# Altium project PCB_Project1.PrjPCB
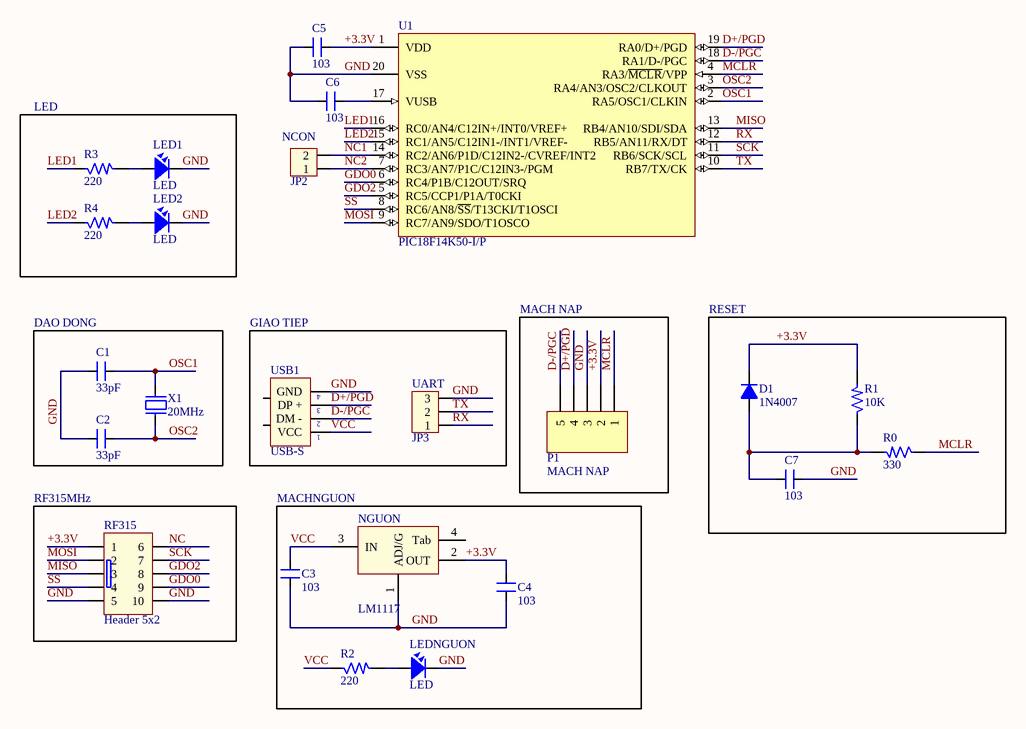
[diagram p0: USB.SchDoc]
1 sheet, 24 parts. Net scope: global (net labels, ports and power ports of the same name join across sheets).
Board files: USB.PcbDoc, UBSRF315.PcbDoc

## Sheet USB.SchDoc
size A

### Parts
C1  33pF  [SM-0805]
C2  33pF  [SM-0805]
C3  103  [SM-0805]
C4  103  [SM-0805]
C5  103  [SM-0805]
C6  103  [CP1/2.5_SM]
C7  103  [SM-0805]
D1  1N4007  [D1A]
LED1  LED  [LED-3]
LED2  LED  [LED-3]
LEDNGUON  LED  [LED-3]
NCON  JP2  [CON2]
NGUON  LM1117  [SOT223-4N]
P1  MACH NAP  [CON5]
R0  330  [SM-0805]
R1  10K  [SM-0805]
R2  220  [SM-0805]
R3  220  [SM-0805]
R4  220  [SM-0805]
RF315  Header 5x2  [HED2X5_cen]
U1  PIC18F14K50-I/P  [SOP-20]
UART  JP3  [CON3]
USB1  USB-S  [USB-A]
X1  20MHz  [XT2]

### Blocks framed on the sheet
LED: LED1 LED2 R3 R4
MACH NAP: P1
RESET: C7 D1 R0 R1
DAO DONG: C1 C2 X1
GIAO TIEP: UART USB1
RF315MHz: RF315
MACHNGUON: C3 C4 LEDNGUON NGUON R2

### Nets
+3.3V: C4.2 C5.2 D1.2(K) NGUON.2(OUT) P1.2 R1.2 RF315.1 U1.1(VDD)
D+/PGD: P1.4 U1.19(RA0/D+/PGD) USB1.3(DP_+)
D-/PGC: P1.5 U1.18(RA1/D-/PGC) USB1.2(DM_-)
GDO0: RF315.9 U1.6(RC4/P1B/C12OUT/SRQ)
GDO2: RF315.8 U1.5(RC5/CCP1/P1A/T0CKI)
GND: C1.1 C2.1 C3.1 C4.1 C5.1 C6.1 C7.1 LED1.2 LED2.2 LEDNGUON.2 NGUON.1(ADJ/G) P1.3 RF315.5 RF315.10 U1.20(VSS) UART.3 USB1.4(GND)
LED1: R3.1 U1.16(RC0/AN4/C12IN+/INT0/VREF+)
LED2: R4.1 U1.15(RC1/AN5/C12IN1-/INT1/VREF-)
MCLR: P1.1 R0.1 U1.4(RA3/~{MCLR}/VPP)
MISO: RF315.3 U1.13(RB4/AN10/SDI/SDA)
MOSI: RF315.2 U1.9(RC7/AN9/SDO/T1OSCO)
NC: RF315.6
NC1: NCON.2 U1.14(RC2/AN6/P1D/C12IN2-/CVREF/INT2)
NC2: NCON.1 U1.7(RC3/AN7/P1C/C12IN3-/PGM)
OSC1: C1.2 U1.2(RA5/OSC1/CLKIN) X1.2
OSC2: C2.2 U1.3(RA4/AN3/OSC2/CLKOUT) X1.1
RX: U1.12(RB5/AN11/RX/DT) UART.1
SCK: RF315.7 U1.11(RB6/SCK/SCL)
SS: RF315.4 U1.8(RC6/AN8/~{SS}/T13CKI/T1OSCI)
TX: U1.10(RB7/TX/CK) UART.2
VCC: C3.2 NGUON.3(IN) R2.1 USB1.1(VCC)
NetC6_2: C6.2 U1.17(VUSB)
NetC7_2: C7.2 D1.1(A) R0.2 R1.1
NetLED1_1: LED1.1 R3.2
NetLED2_1: LED2.1 R4.2
NetLEDNGUON_1: LEDNGUON.1 R2.2

Not connected (* = marked no-connect by the designer): NGUON 4(Tab); USB1 5 6

### Library data of the parts
C1 C2 = CM: Cap SMD; Value: 103
C3-C7 = CM: Cap SMD; Value: 103
D1 = D1A: Diode 1A; Value: 1N4007
LED1 LED2 LEDNGUON = LED: LED Single colour Green and Red; Value: LED 3 ly Single Colour
NCON = Con2: Connector 2; Value: Connector 2
NGUON = LM1117: 3v3; Value: LM317
P1 = Header 5H: Header, 5-Pin, Right Angle; LatestRevisionDate: 17-Jul-2002; LatestRevisionNote: Re-released for DXP Platform.; Publisher: Altium Limited
R0-R4 = R: Resistor 1/4W; Value: R1/4W - 1K
RF315 = HED5x2: Value: Header 5x2
U1 = PIC18F14K50-I/P: USB Flash Microcontroller with nanoWatt XLP Technology, 20-pin PDIP, Industrial Temperature; FirstPublished: 2-Dec-2009; DatasheetVersion: revC, Mar-2009; PackageVersion: revBB, Aug-2009; PackageReference: PDIP300-P20; Publisher: Altium Limited; PackageDescription: 20-Lead Plastic Dual In-Line (P) - 300 mil Body [PDIP]; Supplier 1: Digi-Key; Supplier Part Number 1: PIC18F14K50-I/P-ND; Supplier 2: Farnell; Supplier Part Number 2: 1648501; Supplier 3: Newark; Supplier Part Number 3: 77M3103; ComponentLink1Description: Datasheet; ComponentLink1URL: http://ww1.microchip.com/downloads/en/DeviceDoc/41350C.pdf; ComponentLink2Description: Packaging Specification; ComponentLink2URL: http://www.microchip.com/stellent/groups/techpub_sg/documents/packagingspec/en012702.pdf; ComponentLink3Description: Microchip.com Home; ComponentLink3URL: http://www.microchip.com/
UART = Con3: Connector 3; Value: Connector 3
USB1 = USB_S: USB connector; Value: USB
X1 = XT2: Crystal For all Crystal 2pin.; Value: 4Mhz